# Altium project STM32H743_PCB_Project.PrjPcb
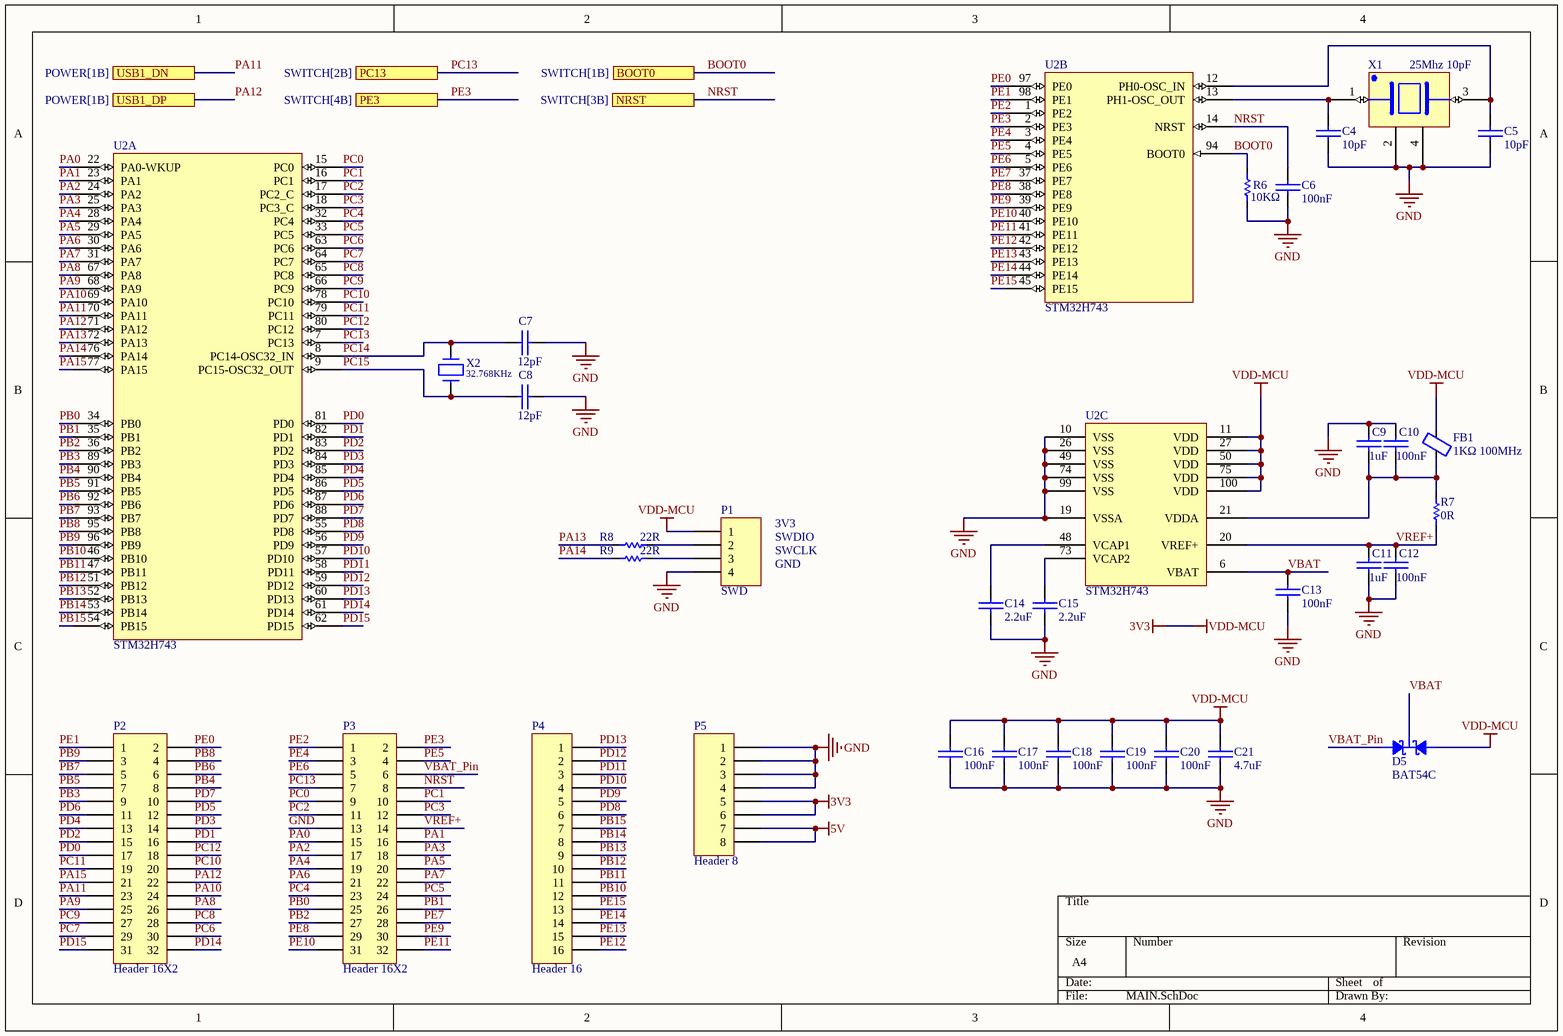
[diagram p0: MAIN.SchDoc]
3 sheets, 60 parts. Net scope: flat (ports and power ports of the same name join across sheets).
Board files: 1_STM32H743.PcbDoc, 2_STM32H743.PcbDoc, 3_STM32H743.PcbDoc, 4_STM32H743.PcbDoc, 5_STM32H743.PcbDoc
Sheets:
  MAIN.SchDoc
  POWER.SchDoc
  SWITCH.SchDoc

## Sheet MAIN.SchDoc
size A4; SheetNumber: 1; SheetTotal: 3; SPICEModelCacheCEDLRVCC: <root> / <DocumentId>CEDLRVCC</DocumentId> / </root>

### Parts
C4  10pF  [0402_Capacitor]
C5  10pF  [0402_Capacitor]
C6  100nF  [0402_Capacitor]
C7  12pF  [0402_Capacitor]
C8  12pF  [0402_Capacitor]
C9  1uF  [0402_Capacitor]
C10  100nF  [0402_Capacitor]
C11  1uF  [0402_Capacitor]
C12  100nF  [0402_Capacitor]
C13  100nF  [0402_Capacitor]
C14  2.2uF  [0402_Capacitor]
C15  2.2uF  [0402_Capacitor]
C16  100nF  [0402_Capacitor]
C17  100nF  [0402_Capacitor]
C18  100nF  [0402_Capacitor]
C19  100nF  [0402_Capacitor]
C20  100nF  [0402_Capacitor]
C21  4.7uF  [0402_Capacitor]
D5  BAT54C  [SOT23_3L]
FB1  1KΩ 100MHz  [0603_Ferrite_Bead]
P1  SWD  [SWD]
P2  Header 16X2  [16x2_Header]
P3  Header 16X2  [16x2_Header]
P4  Header 16  [16x1_Header]
P5  Header 8  [8x1_Header]
R6  10KΩ  [0402_Resistor]
R7  0R  [0402_Resistor]
R8  22R  [0402_Resistor]
R9  22R  [0402_Resistor]
U2  STM32H743  [LQFP100Pin]  (parts A,B,C of 3)
X1  25Mhz 10pF  [XTAL_25MHz]
X2  32.768KHz  [XTAL_32.768KHz]

### Ports
BOOT0 (see SWITCH[1B]), NRST (see SWITCH[3B]), PC13 (see SWITCH[2B]), PE3 (see SWITCH[4B]), USB1_DN (see POWER[1B]), USB1_DP (see POWER[1B])

### Nets
3V3: C16.1 C17.1 C18.1 C19.1 C20.1 C21.1 D5.2 FB1.1 P1.1 P5.5 P5.6 U2.11(VDD) U2.27(VDD) U2.50(VDD) U2.75(VDD) U2.100(VDD)  [also labelled VDD-MCU]
5V: P5.7 P5.8
GND: C4.2 C5.2 C6.2 C7.2 C8.2 C9.1 C10.1 C11.2 C12.2 C13.2 C14.2 C15.2 C16.2 C17.2 C18.2 C19.2 C20.2 C21.2 P1.4 P3.13 P5.1 P5.2 P5.3 P5.4 R6.1 U2.10(VSS) U2.19(VSSA) U2.26(VSS) U2.49(VSS) U2.74(VSS) U2.99(VSS) X1.2 X1.4
BOOT0: R6.2 U2.94(BOOT0) ; port BOOT0
NRST: C6.1 P3.8 U2.14(NRST) ; port NRST
PA0: P3.15 U2.22(PA0-WKUP)
PA1: P3.16 U2.23(PA1)
PA2: P3.17 U2.24(PA2)
PA3: P3.18 U2.25(PA3)
PA4: P3.19 U2.28(PA4)
PA5: P3.20 U2.29(PA5)
PA6: P3.21 U2.30(PA6)
PA7: P3.22 U2.31(PA7)
PA8: P2.26 U2.67(PA8)
PA9: P2.25 U2.68(PA9)
PA10: P2.24 U2.69(PA10)
PA11: P2.23 U2.70(PA11) ; port USB1_DN
PA12: P2.22 U2.71(PA12) ; port USB1_DP
PA13: R8.2 U2.72(PA13)
PA14: R9.2 U2.76(PA14)
PA15: P2.21 U2.77(PA15)
PB0: P3.25 U2.34(PB0)
PB1: P3.26 U2.35(PB1)
PB2: P3.27 U2.36(PB2)
PB3: P2.9 U2.89(PB3)
PB4: P2.8 U2.90(PB4)
PB5: P2.7 U2.91(PB5)
PB6: P2.6 U2.92(PB6)
PB7: P2.5 U2.93(PB7)
PB8: P2.4 U2.95(PB8)
PB9: P2.3 U2.96(PB9)
PB10: P4.12 U2.46(PB10)
PB11: P4.11 U2.47(PB11)
PB12: P4.10 U2.51(PB12)
PB13: P4.9 U2.52(PB13)
PB14: P4.8 U2.53(PB14)
PB15: P4.7 U2.54(PB15)
PC0: P3.9 U2.15(PC0)
PC1: P3.10 U2.16(PC1)
PC2: P3.11 U2.17(PC2_C)
PC3: P3.12 U2.18(PC3_C)
PC4: P3.23 U2.32(PC4)
PC5: P3.24 U2.33(PC5)
PC6: P2.30 U2.63(PC6)
PC7: P2.29 U2.64(PC7)
PC8: P2.28 U2.65(PC8)
PC9: P2.27 U2.66(PC9)
PC10: P2.20 U2.78(PC10)
PC11: P2.19 U2.79(PC11)
PC12: P2.18 U2.80(PC12)
PC13: P3.7 U2.7(PC13) ; port PC13
PC14: C7.1 U2.8(PC14-OSC32_IN) X2.2
PC15: C8.1 U2.9(PC15-OSC32_OUT) X2.1
PD0: P2.17 U2.81(PD0)
PD1: P2.16 U2.82(PD1)
PD2: P2.15 U2.83(PD2)
PD3: P2.14 U2.84(PD3)
PD4: P2.13 U2.85(PD4)
PD5: P2.12 U2.86(PD5)
PD6: P2.11 U2.87(PD6)
PD7: P2.10 U2.88(PD7)
PD8: P4.6 U2.55(PD8)
PD9: P4.5 U2.56(PD9)
PD10: P4.4 U2.57(PD10)
PD11: P4.3 U2.58(PD11)
PD12: P4.2 U2.59(PD12)
PD13: P4.1 U2.60(PD13)
PD14: P2.32 U2.61(PD14)
PD15: P2.31 U2.62(PD15)
PE0: P2.2 U2.97(PE0)
PE1: P2.1 U2.98(PE1)
PE2: P3.1 U2.1(PE2)
PE3: P3.2 U2.2(PE3) ; port PE3
PE4: P3.3 U2.3(PE4)
PE5: P3.4 U2.4(PE5)
PE6: P3.5 U2.5(PE6)
PE7: P3.28 U2.37(PE7)
PE8: P3.29 U2.38(PE8)
PE9: P3.30 U2.39(PE9)
PE10: P3.31 U2.40(PE10)
PE11: P3.32 U2.41(PE11)
PE12: P4.16 U2.42(PE12)
PE13: P4.15 U2.43(PE13)
PE14: P4.14 U2.44(PE14)
PE15: P4.13 U2.45(PE15)
VBAT: C13.1 D5.3 U2.6(VBAT)
VBAT_Pin: D5.1 P3.6
VREF+: C11.1 C12.1 P3.14 R7.1 U2.20(VREF+)
NetC4_1: C4.1 U2.13(PH1-OSC_OUT) X1.1
NetC5_1: C5.1 U2.12(PH0-OSC_IN) X1.3
NetC9_2: C9.2 C10.2 FB1.2 R7.2 U2.21(VDDA)
NetC14_1: C14.1 U2.48(VCAP1)
NetC15_1: C15.1 U2.73(VCAP2)
NetP1_2: P1.2 R8.1
NetP1_3: P1.3 R9.1

### Notes on the sheet
- 3V3
- SWDIO
- SWCLK
- GND

### Library data of the parts
C4-C21 = CAP-Chip: SMDCapacitor
FB1 = FB1
P1 = Header 4H: Header, 4-Pin, Right Angle; LatestRevisionDate: 17-Jul-2002; LatestRevisionNote: Re-released for DXP Platform.; Publisher: Altium Limited
P2 P3 = Header 16X2: Header, 16-Pin, Dual row; LatestRevisionDate: 17-Jul-2002; LatestRevisionNote: Re-released for DXP Platform.; Publisher: Altium Limited
P4 = Header 16: Header, 16-Pin; LatestRevisionDate: 17-Jul-2002; LatestRevisionNote: Re-released for DXP Platform.; Publisher: Altium Limited
P5 = Header 8: Header, 8-Pin; LatestRevisionDate: 17-Jul-2002; LatestRevisionNote: Re-released for DXP Platform.; Publisher: Altium Limited
R6-R9 = Res1: Resistor; Published: 8-Jun-2000; LatestRevisionDate: 17-Jul-2002; LatestRevisionNote: Re-released for DXP Platform.; PackageReference: AXIAL-0.3; Publisher: Altium Limited; PackageDescription: Axial Device, Thru-Hole; 2 Leads; 0.3 in Pin Spacing
X1 = XTAL_25MHz
X2 = CRYSTAL

## Sheet POWER.SchDoc
size A4; SheetNumber: 2; SheetTotal: 3; SPICEModelCacheKGGQNPCM: <root> / <DocumentId>KGGQNPCM</DocumentId> / <CacheFrame Number="0"> / <Model Name="diode" Kind="MDL"> / <Text>*Default Diode / *Diode Pinout: A,K / .MODEL DIODE D()</Text> / </Model> / <Model Name="led0" Kind="MDL"> / <Text>*Typ INFRARED GaAs LED: Vf=1.2V Vr=5V If=40mA trr=3uS / *LED Pinout: 1=A, 2=K / .MODEL LED0 D (IS=93.5P RS=84M N=2.63 BV=5 IBV=10U / + CJO=2.97P VJ=.75 M=.333 TT=4.32U)</Text> / </Model> / </CacheFrame> / </root>
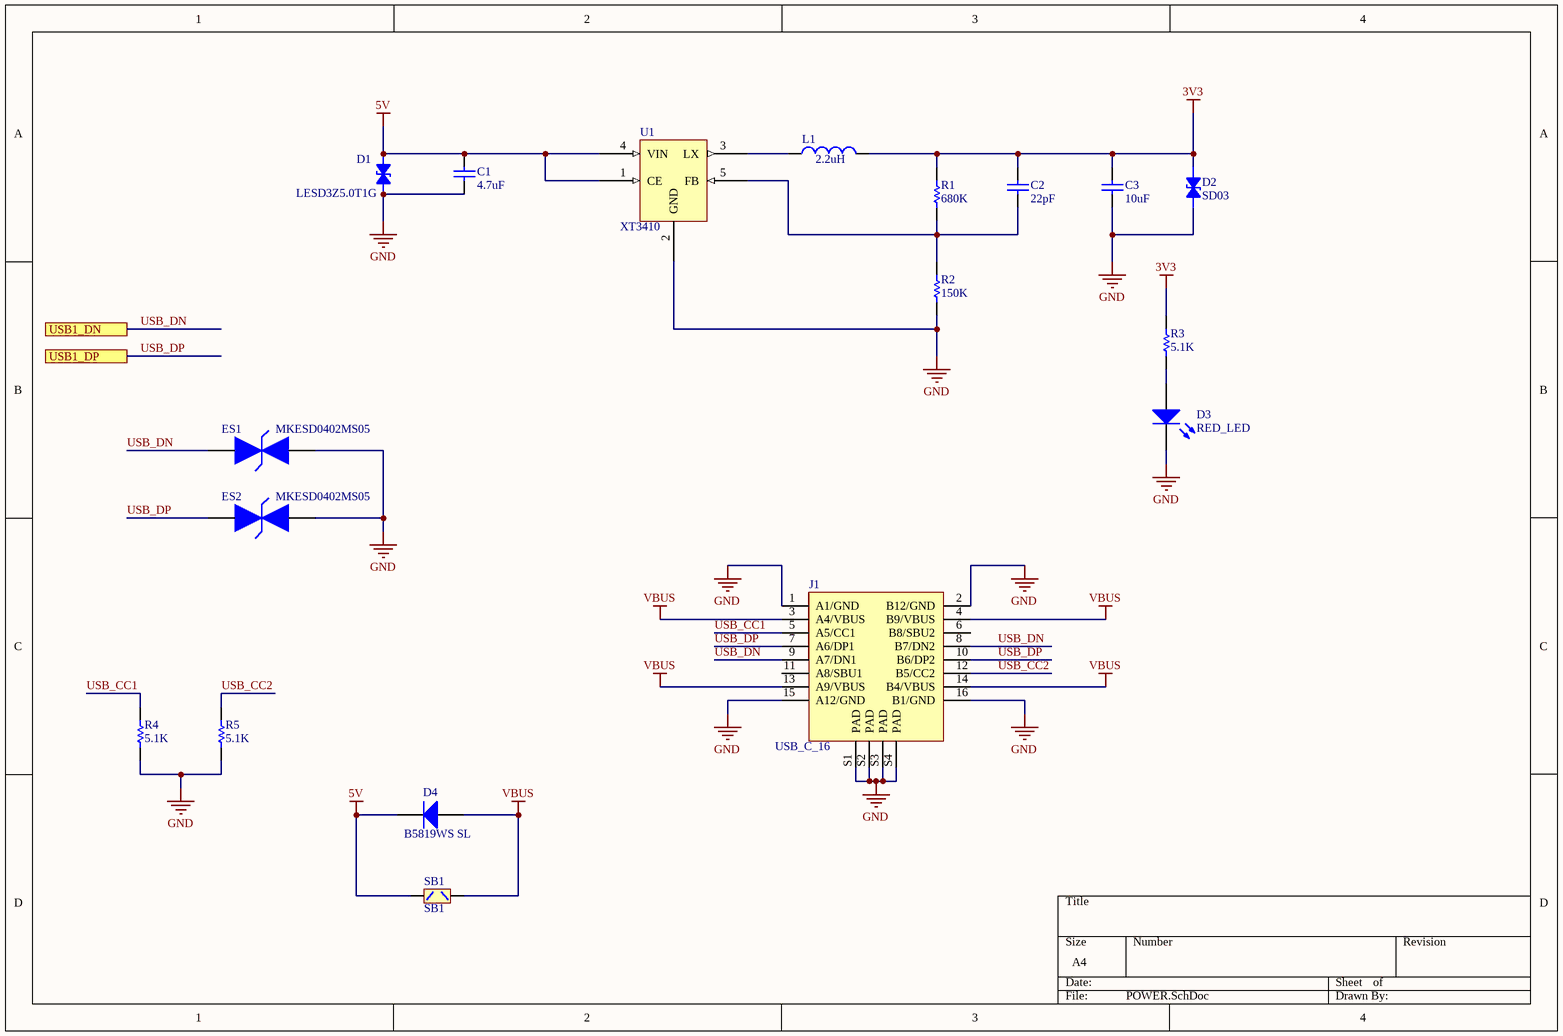
[diagram p1: POWER.SchDoc]

### Parts
C1  4.7uF  [0402_Capacitor]
C2  22pF  [0402_Capacitor]
C3  10uF  [0402_Capacitor]
D1  LESD3Z5.0T1G  [SOD-323]
D2  SD03  [SOD-323]
D3  RED_LED  [0603_LED_RED]
D4  B5819WS SL  [SOD-323]
ES1  MKESD0402MS05  [MKESD0402MS05]
ES2  MKESD0402MS05  [MKESD0402MS05]
J1  USB_C_16  [USB_C_16PIN_DIP]
L1  value 2.2uH  [2220(5650)_Inductor]  (hidden comment: Inductor)
R1  value 680K  [0402_Resistor]  (hidden comment: Res1)
R2  value 150K  [0402_Resistor]  (hidden comment: Res1)
R3  value 5.1K  [0402_Resistor]  (hidden comment: Res1)
R4  value 5.1K  [0402_Resistor]  (hidden comment: Res1)
R5  value 5.1K  [0402_Resistor]  (hidden comment: Res1)
SB1  SB1  [SB]
U1  XT3410  [SOT23_5L]

### Ports
USB1_DN (see MAIN[1A]), USB1_DP (see MAIN[1A])

### Nets
3V3: C2.2 C3.2 D2.1 L1.2 R1.2 R3.2
5V: C1.2 D1.1 D4.2(K) SB1.1 U1.1(CE) U1.4(VIN)
GND: C1.1 C3.1 D1.2 D2.2 D3.2(K) ES1.2 ES2.2 J1.1(A1/GND) J1.2(B12/GND) J1.15(A12/GND) J1.16(B1/GND) J1.S1(PAD) J1.S2(PAD) J1.S3(PAD) J1.S4(PAD) R2.1 R4.1 R5.1 U1.2(GND)
VBUS: D4.1(A) J1.3(A4/VBUS) J1.4(B9/VBUS) J1.13(A9/VBUS) J1.14(B4/VBUS) SB1.2
USB_CC1: J1.5(A5/CC1) R4.2
USB_CC2: J1.12(B5/CC2) R5.2
USB_DN: ES1.1 J1.8(B7/DN2) J1.9(A7/DN1) ; port USB1_DN  [project net PA11]
USB_DP: ES2.1 J1.7(A6/DP1) J1.10(B6/DP2) ; port USB1_DP  [project net PA12]
NetC2_1: C2.1 R1.1 R2.2 U1.5(FB)
NetD3_1: D3.1(A) R3.1
NetL1_1: L1.1 U1.3(LX)

Not connected (* = marked no-connect by the designer): J1 6(B8/SBU2) 11(A8/SBU1)

### Library data of the parts
C1-C3 = Cap: Capacitor; Published: 8-Jun-2000; LatestRevisionDate: 17-Jul-2002; LatestRevisionNote: Re-released for DXP Platform.; PackageReference: RAD-0.3; Publisher: Altium Limited; PackageDescription: Radial Cap, Thru-Hole; 2 Leads; 0.3 in Pin Spacing
  C1: Value: 4.7uF
  C2: Value: 22pF
  C3: Value: 10uF
D1 D2 = Diode
D3 = LED0: Typical INFRARED GaAs LED; Published: 8-Jun-2000; LatestRevisionDate: 08-Jul-2005; LatestRevisionNote: Mech Layer 1 removed.; PackageReference: LED-0; Publisher: Altium Limited; PackageDescription: LED; 2 Leads
D4 = Diode: Default Diode; Published: 8-Jun-2000; LatestRevisionDate: 17-Jul-2002; LatestRevisionNote: Re-released for DXP Platform.; PackageVersion: Sep-1996; PackageReference: SMC; Publisher: Altium Limited; PackageDescription: DO-214-AB/SMC; 2 C-Bend Leads; Body 7.9 x 5.9 mm, inc. leads (LxW); Code_JEDEC: DO-214-AB
ES1 ES2 = ESD1
L1 = Inductor: Code_IEC: 1005; Published: 8-Jun-2000; LatestRevisionDate: 29-May-2009; LatestRevisionNote: IPC-7351 Footprint Added.; PackageReference: 0402-A; Publisher: Altium Limited; PackageDescription: Chip Inductor; Code_JEITA: 0402
R1-R5 = Res1: Resistor; Published: 8-Jun-2000; LatestRevisionDate: 17-Jul-2002; LatestRevisionNote: Re-released for DXP Platform.; PackageReference: AXIAL-0.3; Publisher: Altium Limited; PackageDescription: Axial Device, Thru-Hole; 2 Leads; 0.3 in Pin Spacing
U1 = XT3410_My

## Sheet SWITCH.SchDoc
size A4; SheetNumber: 3; SheetTotal: 3; SPICEModelCacheBBBPLXQV: <root> / <DocumentId>BBBPLXQV</DocumentId> / <CacheFrame Number="0"> / <Model Name="led0" Kind="MDL"> / <Text>*Typ INFRARED GaAs LED: Vf=1.2V Vr=5V If=40mA trr=3uS / *LED Pinout: 1=A, 2=K / .MODEL LED0 D (IS=93.5P RS=84M N=2.63 BV=5 IBV=10U / + CJO=2.97P VJ=.75 M=.333 TT=4.32U)</Text> / </Model> / </CacheFrame> / </root>
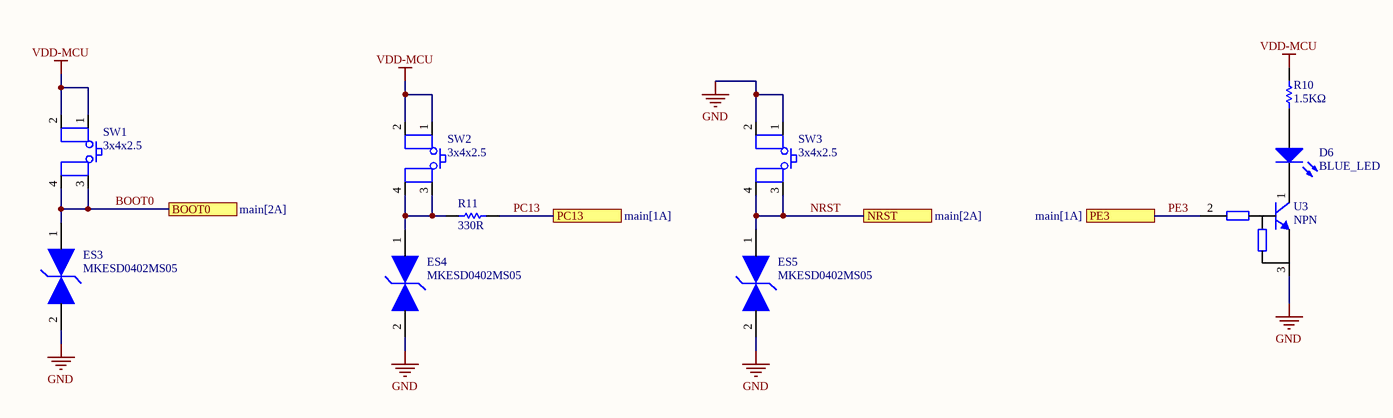
[diagram p2: SWITCH.SchDoc]

### Parts
D6  BLUE_LED  [0603_LED_BLUE]
ES3  MKESD0402MS05  [MKESD0402MS05]
ES4  MKESD0402MS05  [MKESD0402MS05]
ES5  MKESD0402MS05  [MKESD0402MS05]
R10  value 1.5KΩ  [0402_Resistor]  (hidden comment: Res1)
R11  value 330R  [0402_Resistor]  (hidden comment: Res1)
SW1  3x4x2.5  [TACT_switch]
SW2  3x4x2.5  [TACT_switch]
SW3  3x4x2.5  [TACT_switch]
U3  NPN  [SOT23_3L]

### Ports
BOOT0 (see main[2A]), NRST (see main[2A]), PC13 (see main[1A]), PE3 (see main[1A])

### Nets
GND: ES3.2 ES4.2 ES5.2 SW3.1 SW3.2 U3.3
VDD-MCU: R10.1 SW1.1 SW1.2 SW2.1 SW2.2  [project net 3V3]
BOOT0: ES3.1 SW1.3 SW1.4 ; port BOOT0
NRST: ES5.1 SW3.3 SW3.4 ; port NRST
PC13: R11.1 ; port PC13
PE3: U3.2 ; port PE3
NetD6_1: D6.1(A) R10.2
NetD6_2: D6.2(K) U3.1(I)
NetES4_1: ES4.1 R11.2 SW2.3 SW2.4

### Library data of the parts
D6 = LED0: Typical INFRARED GaAs LED; Published: 8-Jun-2000; LatestRevisionDate: 08-Jul-2005; LatestRevisionNote: Mech Layer 1 removed.; PackageReference: LED-0; Publisher: Altium Limited; PackageDescription: LED; 2 Leads
ES3-ES5 = ESD1
R10 R11 = Res1: Resistor; Published: 8-Jun-2000; LatestRevisionDate: 17-Jul-2002; LatestRevisionNote: Re-released for DXP Platform.; PackageReference: AXIAL-0.3; Publisher: Altium Limited; PackageDescription: Axial Device, Thru-Hole; 2 Leads; 0.3 in Pin Spacing
SW1-SW3 = SW1
U3 = NPN_REC2

## Nets that join several sheets
3V3: MAIN (16 pins), POWER (6 pins), SWITCH (5 pins)
5V: MAIN (P5.7 P5.8), POWER (6 pins)
GND: MAIN (33 pins), POWER (19 pins), SWITCH (6 pins)
BOOT0: MAIN (R6.2 U2.94), SWITCH (ES3.1 SW1.3 SW1.4)
NRST: MAIN (C6.1 P3.8 U2.14), SWITCH (ES5.1 SW3.3 SW3.4)
PA11: MAIN (P2.23 U2.70), POWER (ES1.1 J1.8 J1.9)
PA12: MAIN (P2.22 U2.71), POWER (ES2.1 J1.7 J1.10)
PC13: MAIN (P3.7 U2.7), SWITCH (R11.1)
PE3: MAIN (P3.2 U2.2), SWITCH (U3.2)